# EAGLE design schematic (EAGLE 9.6.2)
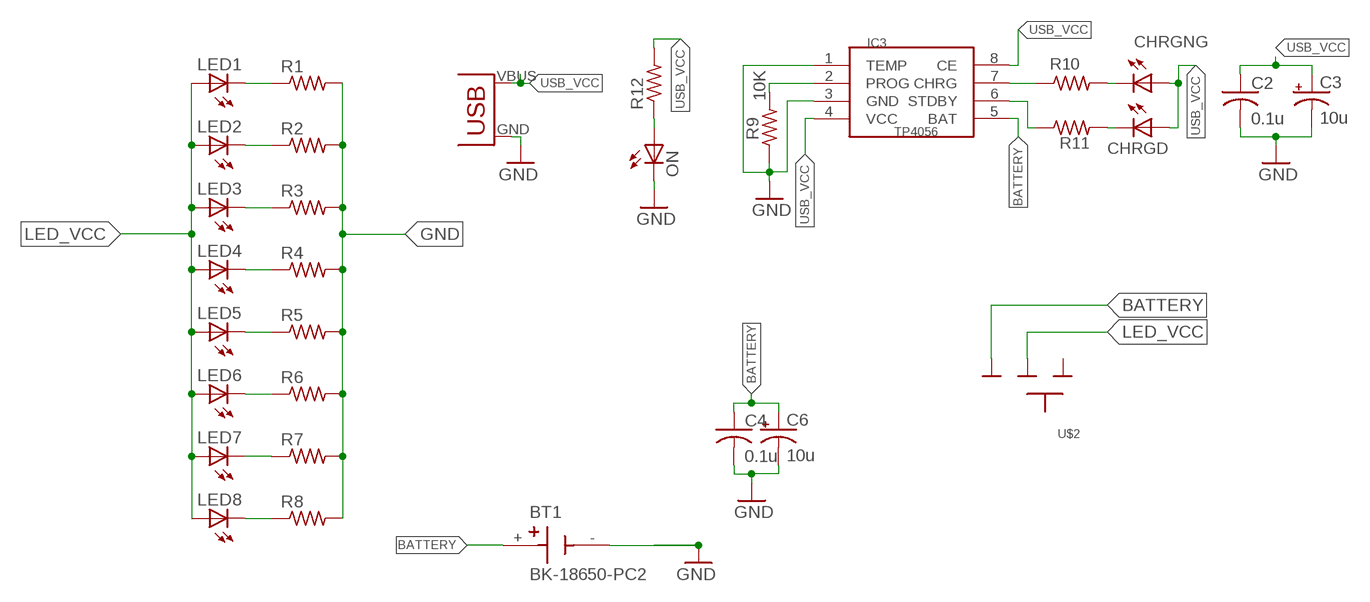
[diagram p0: schematic, sheet 1]

## Parts
BT1  BK-18650-PC2  [BAT_BK-18650-PC2]
C2  0.1u  CAP0805  [C0805]
C3  10u  CAP_POL_16V  [B/3528-21R]
C4  0.1u  CAP0805  [C0805]
C6  10u  CAP_POL_16V  [B/3528-21R]
CHRGD  LED3MM  [LED3MM]
CHRGNG  LED3MM  [LED3MM]
IC3  TP4056  [SOP-8]
LED1  LED5MM  [LED5MM]
LED2  LED5MM  [LED5MM]
LED3  LED5MM  [LED5MM]
LED4  LED5MM  [LED5MM]
LED5  LED5MM  [LED5MM]
LED6  LED5MM  [LED5MM]
LED7  LED5MM  [LED5MM]
LED8  LED5MM  [LED5MM]
ON  LED3MM  [LED3MM]
R1  RESISTOR0207/7  [0207/7]
R2  RESISTOR0207/7  [0207/7]
R3  RESISTOR0207/7  [0207/7]
R4  RESISTOR0207/7  [0207/7]
R5  RESISTOR0207/7  [0207/7]
R6  RESISTOR0207/7  [0207/7]
R7  RESISTOR0207/7  [0207/7]
R8  RESISTOR0207/7  [0207/7]
R9  10K  RESISTOR0207/7  [0207/7]
R10  470  RESISTOR0207/7  [0207/7]
R11  470  RESISTOR0207/7  [0207/7]
R12  RESISTOR0207/7  [0207/7]
U$1  USB(POWER)  [USB(POWER)]
U$2  SLIDESWITCH-SMALL  [SMALLSWITCH]

## Nets
BATTERY: BT1.+ C4.1 C6.+ IC3.5(BAT) U$2.3
GND: BT1.- C2.2 C3.- C4.2 C6.- IC3.1(TEMP) IC3.3(GND) ON.K(C) R1.2 R2.2 R3.2 R4.2 R5.2 R6.2 R7.2 R8.2 R9.1 U$1.GND
LED_VCC: LED1.A LED2.A LED3.A LED4.A LED5.A LED6.A LED7.A LED8.A U$2.2
N$1: LED8.K(C) R8.1
N$2: IC3.2(PROG) R9.2
N$3: LED7.K(C) R7.1
N$4: LED1.K(C) R1.1
N$5: LED2.K(C) R2.1
N$6: IC3.7(CHRG) R10.1
N$7: IC3.6(STDBY) R11.1
N$8: CHRGNG.K(C) R10.2
N$9: LED3.K(C) R3.1
N$10: CHRGD.K(C) R11.2
N$11: LED4.K(C) R4.1
N$12: LED5.K(C) R5.1
N$13: LED6.K(C) R6.1
N$22: ON.A R12.1
USB_VCC: C2.1 C3.+ CHRGD.A CHRGNG.A IC3.4(VCC) IC3.8(CE) R12.2 U$1.VBUS(VCC)
Unconnected: U$2.1

## Library data of the parts
BT1 = BK-18650-PC2:BK-18650-PC2: Battery Holder (Open) 18650 1 Cell PC Pin Check availability <https://pricing.snapeda.com/parts/BK-18650-PC2/MPD%20%28Memory%20Protection%20Devices%29/view-part?ref=eda>; AVAILABILITY: In Stock; DESCRIPTION: Battery Holder (Open) 18650 1 Cell PC Pin; MF: MPD (Memory Protection Devices); MP: BK-18650-PC2; PACKAGE: None; PRICE: None; PURCHASE-URL: https://pricing.snapeda.com/search/part/BK-18650-PC2/?ref=eda
C2 C4 = CEDT_JANUARY_2015_v6:CAP
C3 C6 = CEDT_JANUARY_2015_v6:CAP_POL
CHRGD CHRGNG = Arduino_Hackathon_v5:LED; OC_FARNELL: unknown
IC3 = tp4056:TP4056; OC_FARNELL: unknown
LED1-LED8 = CEDT_JANUARY_2015_v6:LED
ON = CEDT:LED; OC_FARNELL: unknown
R1-R8 = CEDT_JANUARY_2015_v6:RESISTOR
R9-R11 = CEDT_JANUARY_2015_v5:RESISTOR; OC_FARNELL: unknown
R12 = CEDT:RESISTOR; OC_FARNELL: unknown
U$1 = CEDT_JANUARY_2015_v5:USB(POWER)
U$2 = CEDT_JANUARY_2015_v6:SLIDESWITCH

## Net classes
0 default: width 0.406 mm

## Board
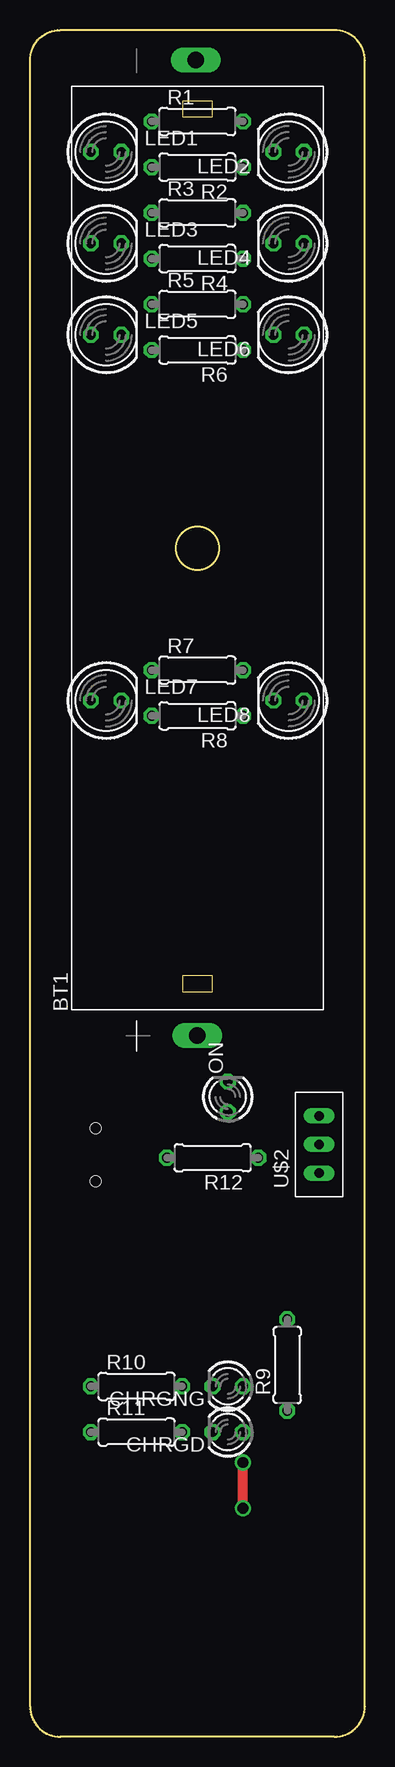
[diagram p1: board, top side]
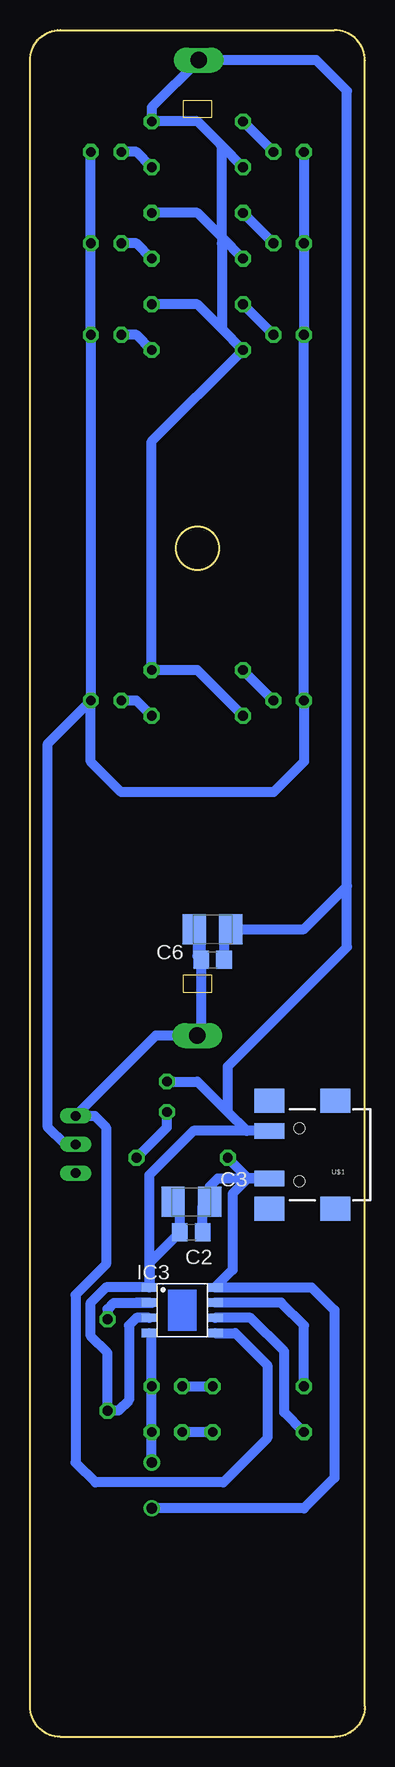
[diagram p2: board, bottom side, seen from below]

Size 27.94 x 142.24 mm. Coordinates in mm from the lower left corner, seen from the top.
Outline: 27.94,2.54 27.94,139.7 arc90 25.4,142.24 2.54,142.24 arc90 0,139.7 0,2.54 arc90 2.54,0 25.4,0 arc90 27.94,2.54
Copper layers (1*16): Top 0.035mm / dielectric 1.5mm / Bottom 0.035mm
Design rules "default": minimum track width 6mil, minimum drill 0.35mm, track to track 6mil, track to pad 6mil, pad to pad 6mil, via to via 6mil, smd to smd 6mil, copper to edge 40mil, drill to drill 6mil, minimum pad ring 10mil, minimum via ring 8mil, stop-mask expansion 4mil, vias tented up to drill 0mil, thermal gap 10mil

### Footprints (pad centres in the part's own frame; a part is rotated, then mirrored left to right if it is on the bottom)
BAT_BK-18650-PC2 = drill 1.38 long: + -40.618,0; - 40.664,0.127
C0805 = smd 1.3 x 1.5: 1 -0.95,0; 2 0.95,0
B/3528-21R = smd 1.95 x 2.5: + 1.525,0; - -1.525,0
LED3MM = drill 0.813 octagon: A -1.27,0; K 1.27,0
SOP-8 = smd 1.3 x 0.7: 1 -2.75,1.905; 2 -2.75,0.635; 3 -2.75,-0.635; 4 -2.75,-1.905; 5 2.75,-1.905; 6 2.75,-0.635; 7 2.75,0.635; 8 2.75,1.905
LED5MM = drill 0.813 octagon: A -1.27,0; K 1.27,0
0207/7 = drill 0.813 octagon: 1 -3.81,0; 2 3.81,0
USB(POWER) = smd 2.54 x 1.27: GND 2.5,-1.981; VBUS 2.5,1.981 | smd 2.5 x 2: GND@1 -3,-4.5; GND@2 -3,4.5; GND@3 2.5,4.5; GND@4 2.5,-4.5 | hole 0.9: 0,2.2; 0,-2.2
SMALLSWITCH = drill 0.8 long: 1 -2.54,0; 2 -0.159,0; 3 2.223,0

### Placement (x,y rotation side)
BT1  13.97,99.06 90 top
C2  14.48,42.04 180 bottom
C3  14.48,44.58 0 bottom
C4  12.7,64.77 0 bottom
C6  12.7,67.31 180 bottom
CHRGD  16.51,25.4 180 top
CHRGNG  16.51,29.21 180 top
IC3  15.24,35.56 0 bottom
LED1  6.35,132.08 0 top
LED2  21.59,132.08 180 top
LED3  6.35,124.46 0 top
LED4  21.59,124.46 180 top
LED5  6.35,116.84 0 top
LED6  21.59,116.84 180 top
LED7  6.35,86.36 0 top
LED8  21.59,86.36 180 top
ON  16.51,53.34 90 top
R1  13.97,134.62 0 top
R2  13.97,130.81 180 top
R3  13.97,127 0 top
R4  13.97,123.19 180 top
R5  13.97,119.38 0 top
R6  13.97,115.57 180 top
R7  13.97,88.9 0 top
R8  13.97,85.09 180 top
R9  21.46,30.99 90 top
R10  8.89,29.21 0 top
R11  8.89,25.4 0 top
R12  15.24,48.26 180 top
U$1  5.46,48.51 180 bottom
U$2  24.13,49.53 90 top

### Tracks (layer width: path | path; a pad name or v marks a point on that pad's centre or on a via)
BATTERY
  Bottom 0.813: IC3.5 10.8,33.66 8.13,30.99 8.13,24.89 11.81,21.21 22.48,21.21 24.13,22.86 24.13,36.83 21.59,39.37 21.59,50.8 22.54,51.75 U$2.3 17.44,58.44 BT1.+ 13.65,58.76 C4.1 | C4.1 13.65,66.99 13.97,67.31 13.97,67.06 | C4.1 13.97,65.09 13.97,67.06 | C6.+ 13.97,67.06
GND
  Bottom 0.813: IC3.1 21.59,37.47 22.86,36.2 22.86,33.4 21.46,32 R9.1 20.57,27.18 19.69,28.07 19.69,34.29 19.05,34.92 IC3.3 | IC3.1 17.99,46.82 14.31,50.49 U$1.GND 9.86,50.49 11.43,52.07 | R8.2 13.97,88.9 R7.2 17.78,107.95 R6.2 11.94,117.35 | 11.43,52.07 11.43,55.88 1.5,65.81 1.5,70.89 | 1.5,70.89 1.5,137.16 4.06,139.72 BT1.- 17.78,135.79 R1.2 13.97,134.62 12.07,132.72 11.94,132.59 | C3.- 15.43,44 C2.2 17.97,39.5 17.97,37.49 IC3.1 | C4.2 11.75,66.73 C6.- 5.08,67.31 1.5,70.89 | ON.K 13.97,54.61 11.43,52.07 | 11.94,117.35 13.97,119.38 R5.2 | R4.2 11.94,124.97 | 11.94,124.97 13.97,127 R3.2 | R2.2 11.94,132.59 | 11.94,124.97 11.94,124.46 11.94,117.35 | 11.94,124.97 11.94,132.59
LED_VCC
  Bottom 0.813: U$2.2 25.01,49.37 26.44,50.8 26.44,82.78 LED8.A | LED1.A LED3.A LED5.A LED7.A 5.08,81.28 7.62,78.74 20.32,78.74 22.86,81.28 LED8.A | LED2.A LED4.A LED6.A LED8.A
N$1
  Bottom 0.813: R8.1 19.05,86.36 LED8.K
N$2
  Bottom 0.813: 19.05,36.17 20.94,36.17 21.46,35.66 R9.2 | 19.05,36.17 17.78,36.17 | IC3.2 19.03,36.2 19.05,36.17
N$3
  Bottom 0.813: LED7.K R7.1
N$4
  Bottom 0.813: LED1.K R1.1
N$5
  Bottom 0.813: R2.1 19.05,132.08 LED2.K
N$6
  Bottom 0.813: R10.1 5.08,34.29 6.99,36.2 IC3.7
N$7
  Bottom 0.813: R11.1 6.73,27.05 6.73,32.13 9.52,34.92 IC3.6
N$8
  Bottom 0.813: CHRGNG.K R10.2
N$9
  Bottom 0.813: LED3.K R3.1
N$10
  Bottom 0.813: R11.2 CHRGD.K
N$11
  Bottom 0.813: R4.1 19.05,124.46 LED4.K
N$12
  Bottom 0.813: LED5.K R5.1
N$13
  Bottom 0.813: R6.1 19.05,116.84 LED6.K
N$22
  Bottom 0.813: R12.1 16.51,50.8 ON.A
USB_VCC  (via drill 0.9)
  Top 0.813: v17.78,19.05 v17.78,22.86
  Bottom 0.813: 9.75,46.53 11.04,45.24 11.04,38.91 IC3.8 4.45,37.47 2.54,35.56 2.54,21.59 5.08,19.05 v17.78,19.05 | 9.75,46.53 U$1.VBUS 12.27,46.53 12.95,45.85 C3.+ 13.21,44.58 13.53,44.26 C2.1 | IC3.4 17.78,33.45 CHRGNG.A CHRGD.A v17.78,22.86 | 9.75,46.53 11.43,48.21 R12.2